# Altium schematic sheet Fonte5V.SchDoc
size A4; Engineer: Kayann Soares; SheetNumber: 8; SheetTotal: 11; CompanyInfo1: Universidade Federal do Ceará; CompanyInfo2: Centro de Tecnologia - CT; CompanyInfo3: Dep. de Eng. de Teleinformática
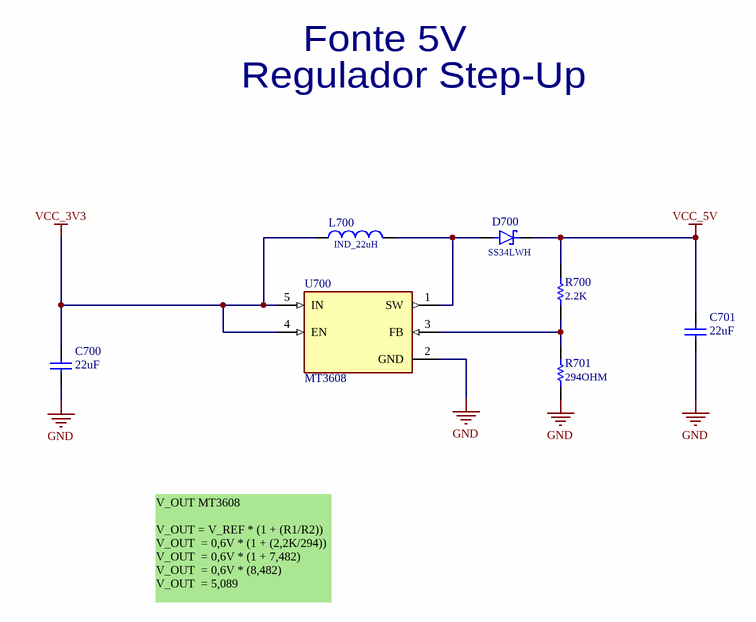
[diagram p0: Fonte5V.SchDoc]

## Parts
C700  22uF  [CAP_CER_0603]
C701  22uF  [CAP_CER_0603]
D700  SS34LWH  [DIODE_SS34LWH]
L700  IND_22uH  [FIXED_IND_22uH]
R700  2.2K  [RES_0603]
R701  294OHM
U700  MT3608  [MT3608]

## Nets
GND: C700.1 C701.1 R701.1 U700.2(GND)
VCC_3V3: C700.2 L700.1 U700.4(EN) U700.5(IN)
VCC_5V: C701.2 D700.C(K) R700.2
NetD700_A: D700.A L700.2 U700.1(SW)
NetR700_1: R700.1 R701.2 U700.3(FB)

## Notes on the sheet
- Fonte 5V
- Regulador Step-Up
- V_OUT MT3608
  V_OUT = V_REF * (1 + (R1/R2))
  V_OUT  = 0,6V * (1 + (2,2K/294))
  V_OUT  = 0,6V * (1 + 7,482)
  V_OUT  = 0,6V * (8,482)
  V_OUT  = 5,089
- Título:
- Padrão:
- Projeto:
- Eng. Responsável:
- A4
- Data:
- Versão:
- Folha:
- V1
- de
- Arquivo:

## Library data of the parts
C700 C701 = CAP_CER_22uF_0603: Supplier 1: Newark; Supplier Part Number 1: 03AC2653
D700 = DIODE_SS34LWH: Supplier 1: Mouser; Supplier Part Number 1: 821-SS34LWHRVG
L700 = FIXED_IND_22uH: Supplier 1: Newark; Supplier Part Number 1: 52K7553
R700 = RES_2.2K_0603: Supplier 1: Future Electronics; Supplier Part Number 1: 3379294
R701 = RES_294OHM_0603: Supplier 1: Future Electronics; Supplier Part Number 1: 1327384